# Altium project SAO_Area3001_S_WS2812_00.PrjPcb
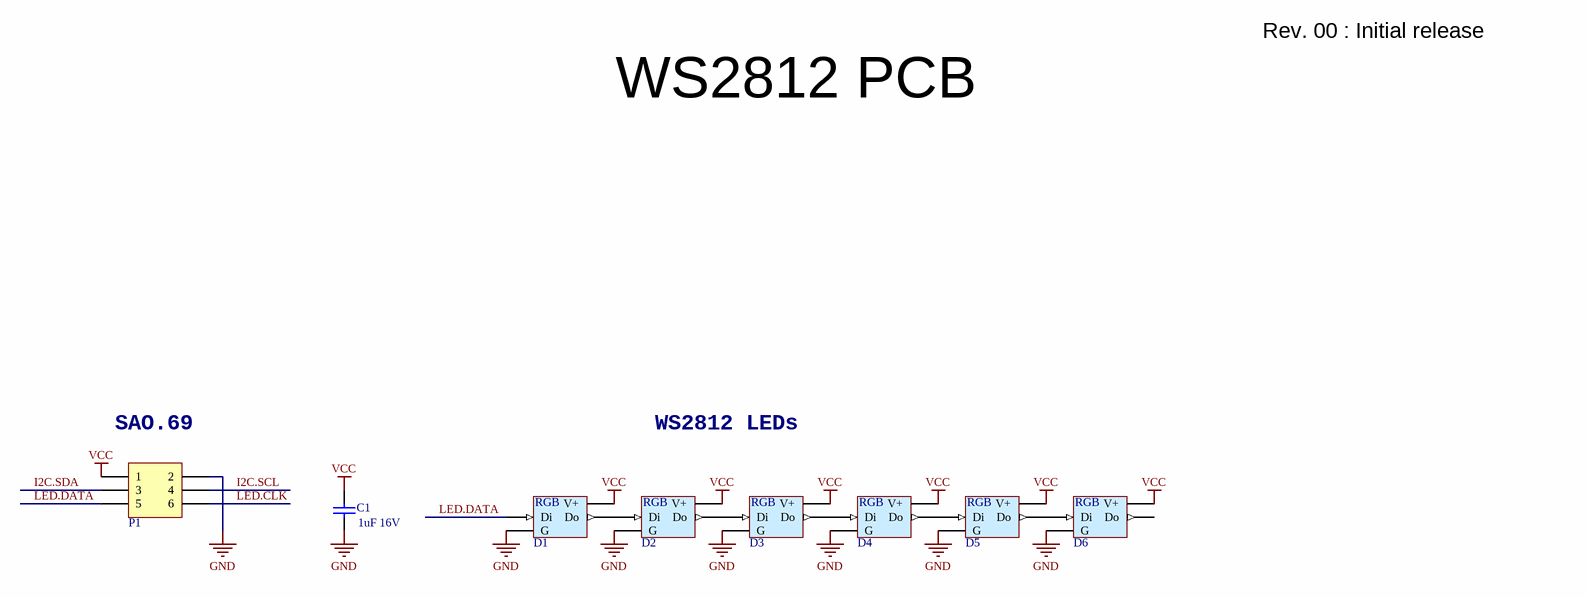
[diagram p0: SAO_Area3001_S_WS2812_00.SchDoc]
PCB_ENGINEER: WimVG; PCB_REV: 00; PCB_TITLE: SAO AREA 3001 S WS2812
1 sheet, 8 parts. Net scope: global (net labels, ports and power ports of the same name join across sheets).
Board file: SAO_Area3001_S_WS2812_00.PcbDoc

## Sheet SAO_Area3001_S_WS2812_00.SchDoc: SAO.69 AREA 3001 Small
size A3; Date: 24/06/2019; DrawnBy: Wim Van Gool; DocumentNumber: 1; Revision: 00; SheetNumber: 1; SheetTotal: 1

### Parts
C1  value 1uF 16V  [C0603_N]  (hidden comment: CAP_CERAMIC)
D1  WS2812 based digital RGB LED 2022 package  [LED_2022_WS2812B]  (value not drawn)
D2  WS2812 based digital RGB LED 2022 package  [LED_2022_WS2812B]  (value not drawn)
D3  WS2812 based digital RGB LED 2022 package  [LED_2022_WS2812B]  (value not drawn)
D4  WS2812 based digital RGB LED 2022 package  [LED_2022_WS2812B]  (value not drawn)
D5  WS2812 based digital RGB LED 2022 package  [LED_2022_WS2812B]  (value not drawn)
D6  WS2812 based digital RGB LED 2022 package  [LED_2022_WS2812B]  (value not drawn)
P1  Boxed Header 3X2  [HDR2X3_SMD]  (value not drawn)

### Nets
GND: C1.2 D1.2(G) D2.2(G) D3.2(G) D4.2(G) D5.2(G) D6.2(G) P1.2
VCC: C1.1 D1.4(V+) D2.4(V+) D3.4(V+) D4.4(V+) D5.4(V+) D6.4(V+) P1.1
I2C.SCL: P1.4
I2C.SDA: P1.3
LED.CLK: P1.6
LED.DATA: D1.3(Di) P1.5
NetD1_1: D1.1(Do) D2.3(Di)
NetD2_1: D2.1(Do) D3.3(Di)
NetD3_1: D3.1(Do) D4.3(Di)
NetD4_1: D4.1(Do) D5.3(Di)
NetD5_1: D5.1(Do) D6.3(Di)

Not connected (* = marked no-connect by the designer): D6 1(Do)

### Notes on the sheet
- Rev. 00 : Initial release
- WS2812 PCB
- (near P1) SAO.69
- WS2812 LEDs
- Title
- Revision
- Date
- Dranw By
- Size
- A3
- Sheet
- of
- (in symbol LED # RGB WS2812B-2022) RGB

### Library data of the parts
C1 = CAP # 1uF 16V 0603: Capacitor Ceramic; Supplier 1: Farnell; Supplier Part Number 1: 2320814
D1-D6 = LED # RGB WS2812B-2022: =Description; Value: WS2812B-2022; Supplier 1: Aliexpress; Supplier Part Number 1: WS2812B 2020 2022; Description: LED # RGB WS2812B-2022
P1 = Pin Header 2.54mm dual row 6way Boxed

## Assembly variants
Default: all parts fitted